# Altium schematic sheet food_box.SchDoc
size Letter
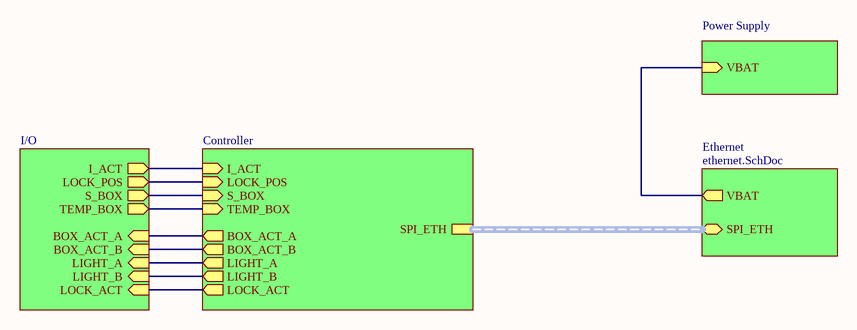
[diagram p0: food_box.SchDoc]

## Sub-sheets
Controller = controller.SchDoc: LOCK_POS (in), S_BOX (in), TEMP_BOX (in), BOX_ACT_A (out), BOX_ACT_B (out), LIGHT_B (out), LIGHT_A (out), LOCK_ACT (out), I_ACT (in), SPI_ETH (harness SPI_ETH)
Ethernet = ethernet.SchDoc: SPI_ETH (bidir, harness SPI_ETH), VBAT (out)
I/O = io.schdoc: LOCK_POS (out), S_BOX (out), TEMP_BOX (out), BOX_ACT_A (in), LIGHT_B (in), LIGHT_A (in), BOX_ACT_B (in), LOCK_ACT (in), I_ACT (out)
Power Supply = power.SchDoc: VBAT (in)

## Nets
(unnamed): sheet Power Supply/VBAT, sheet Ethernet/VBAT
(unnamed): sheet I/O/LOCK_POS, sheet Controller/LOCK_POS
(unnamed): sheet I/O/S_BOX, sheet Controller/S_BOX
(unnamed): sheet I/O/TEMP_BOX, sheet Controller/TEMP_BOX
(unnamed): sheet I/O/BOX_ACT_A, sheet Controller/BOX_ACT_A
(unnamed): sheet I/O/LIGHT_B, sheet Controller/LIGHT_B
(unnamed): sheet I/O/LIGHT_A, sheet Controller/LIGHT_A
(unnamed): sheet I/O/BOX_ACT_B, sheet Controller/BOX_ACT_B
(unnamed): sheet I/O/LOCK_ACT, sheet Controller/LOCK_ACT
(unnamed): sheet I/O/I_ACT, sheet Controller/I_ACT

## Buses and harness runs
harness sheet Controller/SPI_ETH = sheet Ethernet/SPI_ETH

## Notes on the sheet
- Title
- Size:
- Date:
- Letter
- Number:
- Time:
- Revision:
- Sheet
- of
- File: